# EAGLE design NANO33IoTV2.0 (EAGLE 9.4.2)

## Sheet 1 of 2
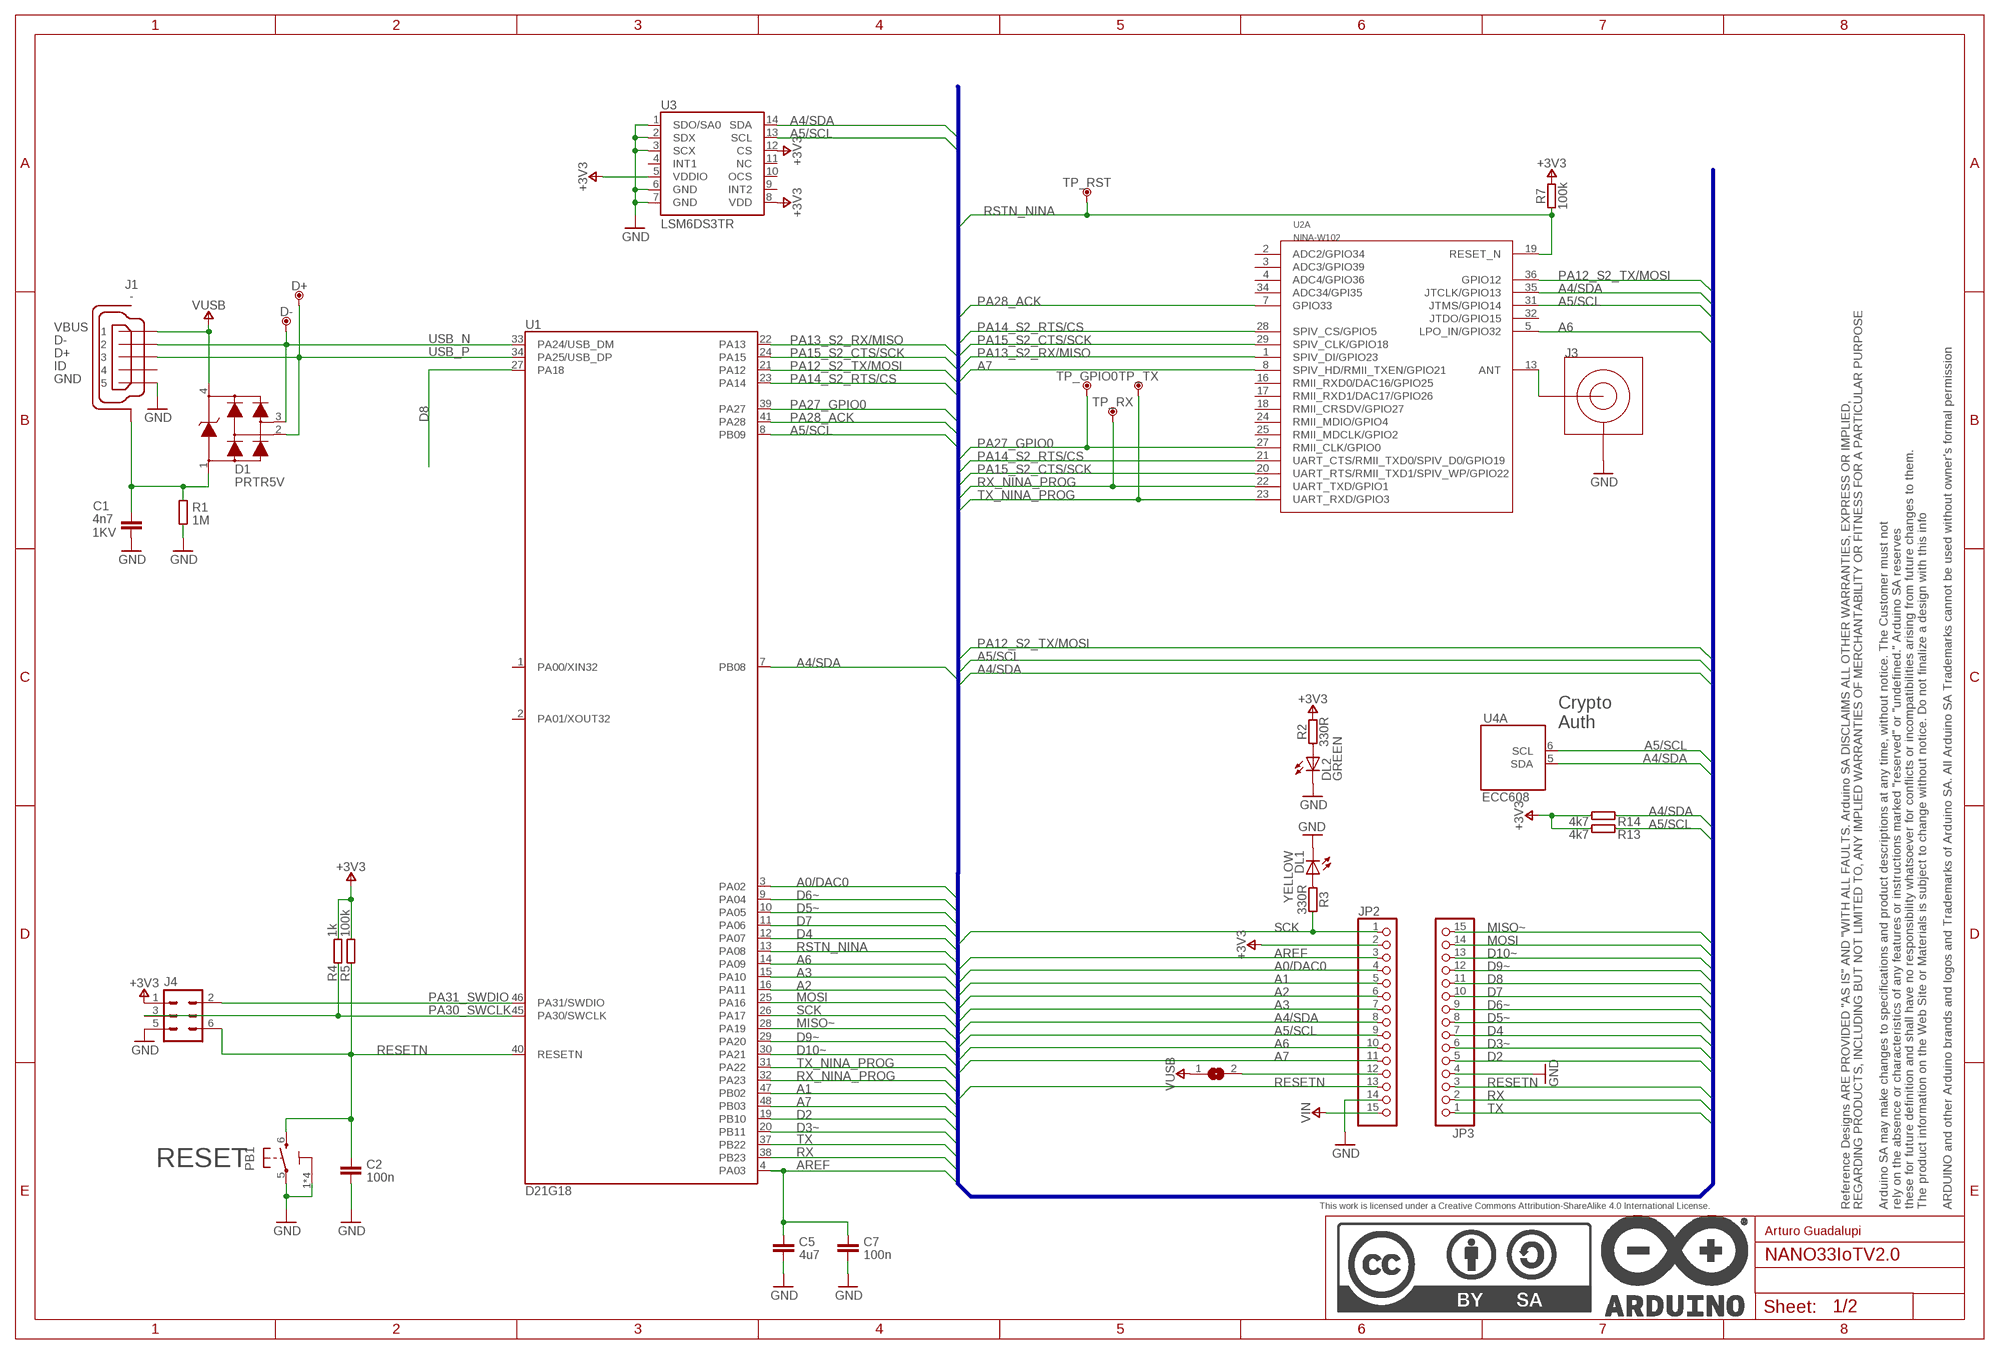
[diagram p0: schematic, sheet 1]

### Parts
C1  4n7  C4.7NF-0805  [0805-R2013X50N]
C2  100n  C-100NF-0402  [0402-1005X55N]
C5  4u7  C-4.7UF-0402  [0402-1005X55N]
C7  100n  C-100NF-0402  [0402-1005X55N]
D1  PRTR5V  PRTR5V0U2X,215  [SOT190P230X110-4N]
D+  DNP  TPTP-1.00MM  [TP-1.00MM]
D-  DNP  TPTP-1.00MM  [TP-1.00MM]
DL1  YELLOW  LED-YELLOW-0603  [LEDC1608X80N-AK]
DL2  GREEN  LED-GREEN-0603  [LEDC1608X80N-AK]
FRAME1  DNP  A3-FRAME  [FRAME]
J1  -  USB-MICRO  [ZX62-AB-5PA]
J3  DNP  UFLNO_CREAM  [U.FL-R-SMT-1(60)/NO_CREAM]
J4  DNP  PINHD-2X03(NO4)  [2X03-TP1]
JP2  PINHD-1X15-CASTELLATED  [1X15-CASTELL]
JP3  PINHD-1X15-CASTELLATED  [1X15-CASTELL]
PB1  PTS820  TACTILE1PTS820-NH  [C&K_PTS820_NO_HOLES]
R1  1M  R-1M-0402  [0402-1005X55N]
R2  330R  R-330R-0402  [0402-1005X55N]
R3  330R  R-330R-0402  [0402-1005X55N]
R4  1k  R-1K-0402  [0402-1005X55N]
R5  100k  R-100K-0402  [0402-1005X55N]
R7  100k  R-100K-0402  [0402-1005X55N]
R13  4k7  R-4K7-0402  [0402-1005X55N]
R14  4k7  R-4K7-0402  [0402-1005X55N]
SJ1  DNP  SJ  [SJ]
TP_GPIO0  DNP  TPTP-0.8MM  [TP-0.8MM]
TP_RST  DNP  TPTP-0.8MM  [TP-0.8MM]
TP_RX  DNP  TPTP-0.8MM  [TP-0.8MM]
TP_TX  DNP  TPTP-0.8MM  [TP-0.8MM]
U1  D21G18  ATSAMD21G18A-48QFN  [QFN50P700X700X90-49XN-EPSQ515]
U2  NINA-W102  NINA-W1X-102  [NINA-W1X]
U3  LSM6DS3TR  LSM6DS3LGA  [LGA14L]
U4  ECC608  ATECC-6088-UDFN  [SON50P300X200X60-9N-EP160X140]

### Nets
+3V3: J4.1 JP2.2 R2.2 R4.2 R5.2 R7.2 R13.2 R14.2 U3.5(VDDIO) U3.8(VDD) U3.12(CS) ; also sheet 2
A0/DAC0: JP2.4 U1.3(PA02)
A1: JP2.5 U1.47(PB02)
A2: JP2.6 U1.16(PA11)
A3: JP2.7 U1.15(PA10)
A4/SDA: JP2.8 R14.1 U1.7(PB08) U2.35(A:JTCLK/GPIO13) U3.14(SDA) U4.5(A:SDA)
A5/SCL: JP2.9 R13.1 U1.8(PB09) U2.31(A:JTMS/GPIO14) U3.13(SCL) U4.6(A:SCL)
A6: JP2.10 U1.14(PA09) U2.5(A:LPO_IN/GPIO32)
A7: JP2.11 U1.48(PB03) U2.8(A:SPIV_HD/RMII_TXEN/GPIO21)
AREF: C5.1 C7.1 JP2.3 U1.4(PA03)
D2: JP3.5 U1.19(PB10)
D3~: JP3.6 U1.20(PB11)
D4: JP3.7 U1.12(PA07)
D5~: JP3.8 U1.10(PA05)
D6~: JP3.9 U1.9(PA04)
D7: JP3.10 U1.11(PA06)
D8: JP3.11 U1.27(PA18)
D9~: JP3.12 U1.29(PA20)
D10~: JP3.13 U1.30(PA21)
GND: C1.2 C2.2 C5.2 C7.2 DL1.C DL2.C J1.5 J3.GND1(GND) J3.GND2(GND) J4.5 JP2.14 JP3.4 PB1.1 PB1.2 PB1.3 PB1.4 PB1.5 R1.1 U3.1(SDO/SA0) U3.2(SDX) U3.3(SCX) U3.6(GND) U3.7(GND) ; also sheet 2
MISO~: JP3.15 U1.28(PA19)
MOSI: JP3.14 U1.25(PA16)
N$1: C1.1 D1.1 J1.6(SH) J1.7(SH) J1.8(SH) J1.9(SH) J1.10(SH) J1.11(SH) R1.2
N$2: DL2.A R2.1
N$3: DL1.A R3.1
N$4: J3.SIG U2.13(A:ANT)
N$8: JP2.12 SJ1.2
PA12_S2_TX/MOSI: U1.21(PA12) U2.36(A:GPIO12)
PA13_S2_RX/MISO: U1.22(PA13) U2.1(A:SPIV_DI/GPIO23)
PA14_S2_RTS/CS: U1.23(PA14) U2.21(A:UART_CTS/RMII_TXD0/SPIV_D0/GPIO19) U2.28(A:SPIV_CS/GPIO5)
PA15_S2_CTS/SCK: U1.24(PA15) U2.20(A:UART_RTS/RMII_TXD1/SPIV_WP/GPIO22) U2.29(A:SPIV_CLK/GPIO18)
PA27_GPIO0: TP_GPIO0.X U1.39(PA27) U2.27(A:RMII_CLK/GPIO0)
PA28_ACK: U1.41(PA28) U2.7(A:GPIO33)
PA30_SWCLK: J4.3 R4.1 U1.45(PA30/SWCLK)
PA31_SWDIO: J4.2 U1.46(PA31/SWDIO)
RESETN: C2.1 J4.6 JP2.13 JP3.3 PB1.6 R5.1 U1.40(RESETN)
RSTN_NINA: R7.1 TP_RST.X U1.13(PA08) U2.19(A:RESET_N)
RX: JP3.2 U1.38(PB23)
RX_NINA_PROG: TP_RX.X U1.32(PA23) U2.22(A:UART_TXD/GPIO1)
SCK: JP2.1 R3.2 U1.26(PA17)
TX: JP3.1 U1.37(PB22)
TX_NINA_PROG: TP_TX.X U1.31(PA22) U2.23(A:UART_RXD/GPIO3)
USB_N [usb]: D1.3 D-.X J1.2 U1.33(PA24/USB_DM)
USB_P [usb]: D1.2 D+.X J1.3 U1.34(PA25/USB_DP)
VIN: JP2.15 ; also sheet 2
VUSB: D1.4 J1.1 SJ1.1 ; also sheet 2
Unconnected: J1.4 U1.1(PA00/XIN32) U1.2(PA01/XOUT32) U2.2(A:ADC2/GPIO34) U2.3(A:ADC3/GPIO39) U2.4(A:ADC4/GPIO36) U2.16(A:RMII_RXD0/DAC16/GPIO25) U2.17(A:RMII_RXD1/DAC17/GPIO26) U2.18(A:RMII_CRSDV/GPIO27) U2.24(A:RMII_MDIO/GPIO4) U2.25(A:RMII_MDCLK/GPIO2) U2.32(A:JTDO/GPIO15) U2.34(A:ADC34/GPI35) U3.4(INT1) U3.9(INT2) U3.10(OCS) U3.11(NC)

### Buses
+3V3,+3V3D,A0,A0/DAC0,A1,A2,A3,A4/SDA,A5/SCL,A6,A7,AREF,D2,D3~,D4,D5~,D6~,D7,D8,D9~,D10~,GND,LED_BLUE,LED_GREEN,LED_RED,MISO~,MOSI,PA12_S2_TX/MOSI,PA13_S2_RX/MISO,PA14_S2_RTS/CS,PA15_S2_CTS/SCK,PA22_TC4-W0,PA23_TC4-W1,PA27_GPIO0,PA28_ACK,PA30_SWCLK,PA31_SWDIO,PB08_RST,PB11_TCC0-W5,RESET#,RESETN,RSTN_NINA,RX,RX_NINA_PROG,SCK,TX,TX_NINA_PROG,USB_N,USB_P,VIN
+3V3,+3V3D,A0/DAC0,A1,A2,A3,A4/SDA,A5/SCL,A6,A7,AREF,D2,D3~,D4,D5~,D6~,D7,D8,D9~,D10~,GND,LED_BLUE,LED_GREEN,LED_RED,MISO~,MOSI,N$1,N$2,N$3,N$5,N$6,N$7,N17852357,N17852431,PA12_S2_TX/MOSI,PA13_S2_RX/MISO,PA14_S2_RTS/CS,PA15_S2_CTS/SCK,PA27_GPIO0,PA28_ACK,PA30_SWCLK,PA31_SWDIO,PB08_RST,RESETN,RSTN_NINA,RX,RX_NINA_PROG,SCK,TX,TX_NINA_PROG,USB_N,USB_P,VIN,VUSB

### Notes on the sheet
- Crypto
  Auth
- RESET
- Arturo Guadalupi

## Sheet 2 of 2
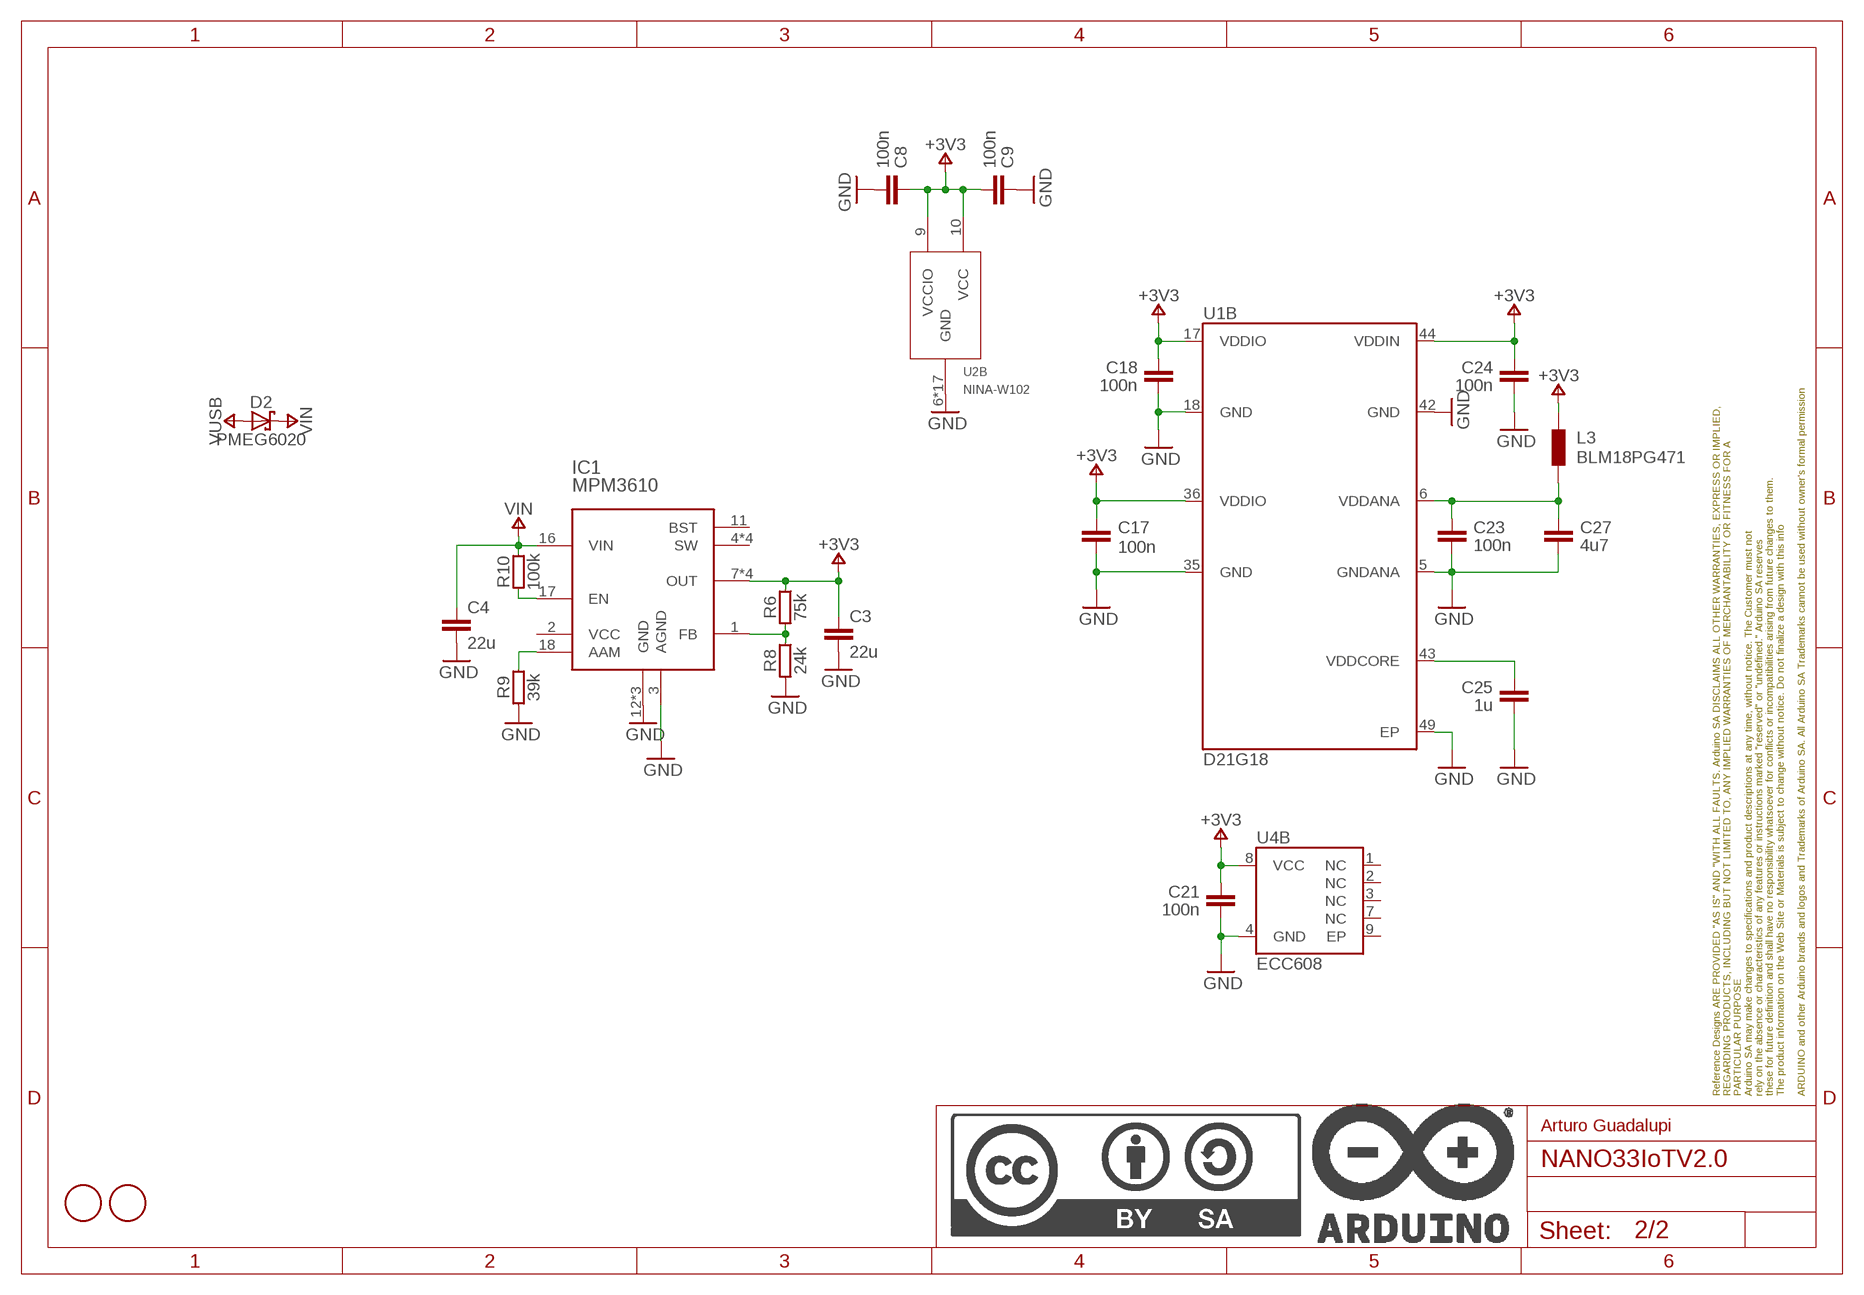
[diagram p1: schematic, sheet 2]

### Parts
C3  22u  C-22U-0805  [0805-R2013X50N]
C4  22u  C-22U-0805  [0805-R2013X50N]
C8  100n  C-100NF-0402  [0402-1005X55N]
C9  100n  C-100NF-0402  [0402-1005X55N]
C17  100n  C-100NF-0402  [0402-1005X55N]
C18  100n  C-100NF-0402  [0402-1005X55N]
C21  100n  C-100NF-0402  [0402-1005X55N]
C23  100n  C-100NF-0402  [0402-1005X55N]
C24  100n  C-100NF-0402  [0402-1005X55N]
C25  1u  C-1UF-0402  [0402-1005X55N]
C27  4u7  C-4.7UF-0603  [0603-1608X90N]
D2  PMEG6020  PMEG6020AELRX  [SODFL3517X110N]
FD1  DNP  FIDUCIAL-1.5MM  [FD-1-1.5]
FD2  DNP  FIDUCIAL-1.5MM  [FD-1-1.5]
IC1  MPM3610  [MPM3610]
L3  BLM18PG471  FERRITE-470R0603  [0603-1608X90N]
R6  75k  R-75K-0402  [0402-1005X55N]
R8  24k  R-24K-0402  [0402-1005X55N]
R9  39k  R-39K-0402  [0402-1005X55N]
R10  100k  R-100K-0402  [0402-1005X55N]
U$1  DNP  A4L-LOC  [FRAME]

### Nets
+3V3: C3.1 C8.1 C9.2 C17.1 C18.1 C21.1 C24.1 IC1.7(OUT) IC1.8(OUT) IC1.9(OUT) IC1.20(OUT) L3.1 R6.2 U1.17(VDDIO) U1.36(VDDIO) U1.44(VDDIN) U2.9(B:VCCIO) U2.10(B:VCC) U4.8(B:VCC) ; also sheet 1
GND: C3.2 C4.2 C8.2 C9.1 C17.2 C18.2 C21.2 C23.2 C24.2 C25.2 C27.2 IC1.3(AGND) IC1.12(GND) IC1.13(GND) IC1.14(GND) R8.1 R9.1 U1.5(GNDANA) U1.18(GND) U1.35(GND) U1.42(GND) U1.49(EP) U2.6(B:GND) U2.12(B:GND) U2.14(B:GND) U2.26(B:GND) U2.30(B:GND) U2.GND@1(B:GND) U2.GND@2(B:GND) U2.GND@3(B:GND) U2.GND@4(B:GND) U2.GND@5(B:GND) U2.GND@6(B:GND) U2.GND@7(B:GND) U2.GND@8(B:GND) U2.GND@9(B:GND) U2.GND@10(B:GND) U2.GND@11(B:GND) U2.GND@12(B:GND) U4.4(B:GND) ; also sheet 1
N17852357: C23.1 C27.1 L3.2 U1.6(VDDANA)
N17852431: C25.1 U1.43(VDDCORE)
N$5: IC1.1(FB) R6.1 R8.2
N$6: IC1.18(AAM) R9.2
N$7: IC1.17(EN) R10.1
VIN: C4.1 D2.C IC1.16(VIN) R10.2 ; also sheet 1
VUSB: D2.A ; also sheet 1
Unconnected: IC1.2(VCC) IC1.4(SW) IC1.5(SW) IC1.6(SW) IC1.11(BST) IC1.19(SW) U4.1(B:NC) U4.2(B:NC) U4.3(B:NC) U4.7(B:NC) U4.9(B:EP)

### Notes on the sheet
- Arturo Guadalupi

## Library data of the parts
C1 = Arduino-rcl:C: SMD Capacitor; CODE-ARDUINO: 0689; DATASHEET: http://www.kemet.com/Lists/ProductCatalog/Attachments/40/KEM_C1010_X7R_HV_SMD.pdf; DISTRIBUTOR-LINK: www.kemet.com/docfinder?Partnumber=C0805C472KDRACTU; DISTRIBUTOR-PN: 399-6738-1-ND; MANUFACTURER: Kemet; MANUFACTURER-PN: C0805C472KDRACTU; NOTE: -; VOLTAGE: 1KV
C2 C7-C9 C17 C18 C21 C23 C24 = Arduino-rcl:C: SMD Capacitor; CODE-ARDUINO: 0132; DATASHEET: http://www.tdk.com/pdf/TDKMLCCCapRange.pdf; DISTRIBUTOR-LINK: http://www.digikey.com/product-detail/en/tdk-corporation/C1005X5R1H104K050BB/445-5942-1-ND/2443982; DISTRIBUTOR-PN: 445-5942-1-ND; MANUFACTURER: TDK; MANUFACTURER-PN: C1005X5R1H104K050BB; NOTE: -
C3 C4 = Arduino-rcl:C: SMD Capacitor; CODE-ARDUINO: 2233; DATASHEET: https://media.digikey.com/pdf/Data%20Sheets/Samsung%20PDFs/CL21A226MQCLQNC_character.pdf; DISTRIBUTOR-LINK: https://www.digikey.com/product-detail/en/samsung-electro-mechanics-america-inc/CL21A226MQCLQNC/1276-2412-1-ND/3890498; DISTRIBUTOR-PN: 1276-2412-1-ND; MANUFACTURER: Samsung; MANUFACTURER-PN: CL21A226MQCLQNC; NOTE: -
C5 = Arduino-rcl:C: SMD Capacitor; CODE-ARDUINO: 0833; DATASHEET: http://search.murata.co.jp/Ceramy/image/img/A01X/partnumbering_e_01.pdf; DISTRIBUTOR-LINK: http://www.digikey.com/product-detail/en/murata-electronics-north-america/GRM155R60J475ME47D/490-5915-1-ND/3719860; DISTRIBUTOR-PN: 490-5915-1-ND; MANUFACTURER: Murata; MANUFACTURER-PN: GRM155R60J475ME47D; NOTE: -
C25 = Arduino-rcl:C: SMD Capacitor; CODE-ARDUINO: 0133; DATASHEET: http://search.murata.co.jp/Ceramy/image/img/A01X/partnumbering_e_01.pdf; DISTRIBUTOR-LINK: http://www.digikey.com/product-detail/en/murata-electronics-north-america/GRM155R61E105KA12D/490-10017-1-ND/5026367; DISTRIBUTOR-PN: 490-10017-1-ND; MANUFACTURER: Murata; MANUFACTURER-PN: GRM155R61E105KA12D; NOTE: -
C27 = Arduino-rcl:C: SMD Capacitor; CODE-ARDUINO: 0458; DATASHEET: http://www.murata.com/~/media/webrenewal/support/library/catalog/products/capacitor/mlcc/c02e.pdf; DISTRIBUTOR-LINK: http://www.digikey.com/product-search/en?keywords=490-7203-1-ND; DISTRIBUTOR-PN: 490-7203-1-ND; MANUFACTURER: Murata; MANUFACTURER-PN: GRM188R61E475KE11D; NOTE: -
D1 = Arduino-diodes:PRTR5V0U2X,215: USB ESD protection; CODE-ARDUINO: 2209; DATASHEET: http://www.nxp.com/documents/data_sheet/PRTR5V0U2X.pdf; DISTRIBUTOR-LINK: http://www.digikey.com/product-detail/en/nxp-semiconductors/PRTR5V0U2X,215/568-4140-1-ND/1589981; DISTRIBUTOR-PN: 568-4140-1-ND; MANUFACTURER: NXP; MANUFACTURER-PN: PRTR5V0U2X,215
D2 = Arduino-diodes:PMEG6020AELRX: 60 V, 2 A low leakage current Schottky barrier rectifier Datasheet <http://www.nxp.com/documents/data_sheet/PMEG6020AELR.pdf>; CODE-ARDUINO: 2208; DATASHEET: http://www.nxp.com/documents/data_sheet/PMEG6020AELR.pdf; DISTRIBUTOR-LINK: http://www.digikey.com/products/en?keywords=%20568-12710-1-ND; DISTRIBUTOR-PN: 568-12710-1-ND; MANUFACTURER: NXP; MANUFACTURER-PN: PMEG6020AELRX
D+ D- TP_GPIO0 TP_RST TP_RX TP_TX = Arduino-utility:TP: Testpoint; CODE-ARDUINO: DNP; DATASHEET: DNP; DISTRIBUTOR-LINK: DNP; DISTRIBUTOR-PN: DNP; MANUFACTURER: DNP; MANUFACTURER-PN: DNP
DL1 = Arduino-diodes:LED: LED; CODE-ARDUINO: 2243; DATASHEET: http://media.digikey.com/pdf/Data%20Sheets/Avago%20PDFs/HSMz-Czzz.pdf; DISTRIBUTOR-LINK: http://www.digikey.com/product-detail/en/broadcom-limited/HSMY-C190/516-1424-1-ND/637748; DISTRIBUTOR-PN: 516-1424-1-ND; MANUFACTURER: Avago; MANUFACTURER-PN: HSMY-C190
DL2 = Arduino-diodes:LED: LED; CODE-ARDUINO: 2204; DATASHEET: http://media.digikey.com/pdf/Data%20Sheets/Avago%20PDFs/HSMz-Czzz.pdf; DISTRIBUTOR-LINK: http://www.digikey.com/product-detail/en/broadcom-limited/HSMG-C190/516-1425-1-ND/637749; DISTRIBUTOR-PN: 516-1425-1-ND; MANUFACTURER: Avago; MANUFACTURER-PN: HSMG-C190
FD1 FD2 = Arduino-utility:FIDUCIAL: Fiducial mount; CODE-ARDUINO: DNP; DATASHEET: DNP; DISTRIBUTOR-LINK: DNP; DISTRIBUTOR-PN: DNP; MANUFACTURER: DNP; MANUFACTURER-PN: DNP
FRAME1 = Arduino-utility:A3-FRAME; CODE-ARDUINO: DNP; DATASHEET: DNP; DISTRIBUTOR-LINK: DNP; DISTRIBUTOR-PN: DNP; MANUFACTURER: DNP; MANUFACTURER-PN: DNP; NOTE: DNP
IC1 = Arduino-ICs:MPM3610: MPM3610 Step Down Regulator; CODE-ARDUINO: 2093; DATASHEET: https://www.monolithicpower.com/pub/media/document/MPM3610_r1.01.pdf; DISTRIBUTOR-LINK: https://www.digikey.com/product-detail/en/monolithic-power-systems-inc/MPM3610AGQV-P/1589-1249-1-ND/5298336; DISTRIBUTOR-PN: 1589-1249-1-ND; MANUFACTURER: MPS; MANUFACTURER-PN: MPM3610AGQV-P; RESTRICTIONS: NO
J1 = Arduino-connectors:USB-MICRO: USB - micro AB USB 2.0 Receptacle Connector 5 Position Surface Mount, Right Angle, Horizontal; CODE-ARDUINO: 2219; DATASHEET: https://www.hirose.com/product/en/download_file/key_name/ZX/category/Catalog/doc_file_id/31704/?file_category_id=4&item_id=13&is_series=1; DISTRIBUTOR-LINK: http://www.digikey.com/product-detail/en/hirose-electric-co-ltd/ZX62-AB-5PA(31)/H125279CT-ND/5994741; DISTRIBUTOR-PN: H125279CT-ND; MANUFACTURER: Hirose; MANUFACTURER-PN: ZX62-AB-5PA(31)
J3 = Arduino-connectors:UFL: U.FL, Ultra Miniature Coaxial Connector Receptacle, Male Pin 50 Ohm Surface Mount Solder; CODE-ARDUINO: DNP; DATASHEET: DNP; DISTRIBUTOR-PN: DNP; MANUFACTURER: DNP; MANUFACTURER-PN: DNP
J4 = Arduino-connectors:PINHD-2X03(NO4): PIN HEADER; CODE-ARDUINO: DNP; DATASHEET: DNP; DISTRIBUTOR-LINK: DNP; DISTRIBUTOR-PN: DNP; MANUFACTURER: DNP; MANUFACTURER-PN: DNP
JP2 JP3 = Arduino-connectors:PINHD-1X15: PIN HEADER
L3 = Arduino-rcl:FERRITE: SMD ferrite; CODE-ARDUINO: 2200; DATASHEET: http://search.murata.co.jp/Ceramy/image/img/PDF/ENG/L0110S0100BLM18P.pdf; DISTRIBUTOR-LINK: http://www.digikey.com/product-detail/en/murata-electronics-north-america/BLM18PG471SN1D/490-5223-1-ND/1948399; DISTRIBUTOR-PN: 490-5223-1-ND; MANUFACTURER: Murata; MANUFACTURER-PN: BLM18PG471SN1D; NOTE: -
PB1 = Arduino-pushbuttons:TACTILE1: Tactile Switch SPST-NO Top Actuated Surface Mount; CODE-ARDUINO: 0173; DATASHEET: http://www.ckswitches.com/media/1474/pts820.pdf; DISTRIBUTOR-LINK: https://www.digikey.com/product-detail/en/c-k/PTS820-J15M-SMTR-LFS/CKN10506CT-ND/4176681; DISTRIBUTOR-PN: PTS820 J25K SMTR LFS-ND; MANUFACTURER: C&K; MANUFACTURER-PN: PTS820 J25K SMTR LFS
R1 = Arduino-rcl:R: SMD Resistor; CODE-ARDUINO: 0139; DATASHEET: www.yageo.com.tw/exep/pages/download/literatures/PYu-R_INT-thick_7.pdf; DISTRIBUTOR-LINK: http://www.digikey.com/product-detail/en/yageo/RC0402JR-07330RL/311-330JRCT-ND/729412; DISTRIBUTOR-PN: 311-330JRCT-ND; MANUFACTURER: Yageo; MANUFACTURER-PN: RC0402JR-07330RL; NOTE: NO
R2 R3 = Arduino-rcl:R: SMD Resistor; CODE-ARDUINO: 2229; DATASHEET: www.yageo.com.tw/exep/pages/download/literatures/PYu-R_INT-thick_7.pdf; DISTRIBUTOR-LINK: http://www.digikey.com/product-detail/en/yageo/RC0402FR-07330RL/311-330LRCT-ND/729541; DISTRIBUTOR-PN: 311-330LRCT-ND; MANUFACTURER: Yageo; MANUFACTURER-PN: RC0402FR-07330RL; NOTE: NO
R4 = Arduino-rcl:R: SMD Resistor; CODE-ARDUINO: 0140; DATASHEET: www.yageo.com.tw/exep/pages/download/literatures/PYu-R_INT-thick_7.pdf; DISTRIBUTOR-LINK: http://www.digikey.com/product-detail/en/yageo/RC0402FR-071KL/311-1.00KLRCT-ND/729460; DISTRIBUTOR-PN: 311-1.00KLRCT-ND; MANUFACTURER: Yageo; MANUFACTURER-PN: RC0402FR-071KL; NOTE: NO
R5 R7 R10 = Arduino-rcl:R: SMD Resistor; CODE-ARDUINO: 0134; DATASHEET: www.yageo.com.tw/exep/pages/download/literatures/PYu-R_INT-thick_7.pdf; DISTRIBUTOR-LINK: http://www.digikey.com/product-detail/en/yageo/RC0402FR-07100KL/311-100KLRCT-ND/729473; DISTRIBUTOR-PN: 311-100KLRCT-ND; MANUFACTURER: Yageo; MANUFACTURER-PN: RC0402FR-07100KL; NOTE: NO
R6 = Arduino-rcl:R: SMD Resistor; DATASHEET: www.yageo.com.tw/exep/pages/download/literatures/PYu-R_INT-thick_7.pdf; DISTRIBUTOR-LINK: https://www.digikey.com/products/en?keywords=%20AC0402JR-0775KL; DISTRIBUTOR-PN: AC0402JR-0775KL-ND; MANUFACTURER: Yageo; MANUFACTURER-PN: AC0402JR-0775KL; NOTE: NO
R8 = Arduino-rcl:R: SMD Resistor; CODE-ARDUINO: -; DATASHEET: http://www.yageo.com/NewPortal/yageodocoutput?fileName=/pdf/R-Chip/PYu-AC_51_RoHS_L_6.pdf; DISTRIBUTOR-LINK: https://www.digikey.com/products/en?keywords=AC0402JR-0724KL; DISTRIBUTOR-PN: AC0402JR-0724KL-ND; MANUFACTURER: Yageo; MANUFACTURER-PN: AC0402JR-0724KL; NOTE: NO
R9 = Arduino-rcl:R: SMD Resistor; CODE-ARDUINO: -; DATASHEET: www.yageo.com.tw/exep/pages/download/literatures/PYu-R_INT-thick_7.pdf; DISTRIBUTOR-LINK: https://www.digikey.com/product-detail/en/yageo/RC0402JR-0739KL/311-39KJRCT-ND/729420; DISTRIBUTOR-PN: 311-39KJRCT-ND; MANUFACTURER: Yageo; MANUFACTURER-PN: RC0402JR-0739KL; NOTE: NO
R13 R14 = Arduino-rcl:R: SMD Resistor; CODE-ARDUINO: 2196; DATASHEET: www.yageo.com.tw/exep/pages/download/literatures/PYu-R_INT-thick_7.pdf; DISTRIBUTOR-LINK: http://www.digikey.com/product-detail/en/yageo/RC0402FR-074K7L/311-4.7KLRCT-ND/2827881; DISTRIBUTOR-PN: 311-4.7KLRCT-ND; MANUFACTURER: Yageo; MANUFACTURER-PN: RC0402FR-074K7L; NOTE: NO
SJ1 = Arduino-utility:SJ: SMD solder JUMPER; CODE-ARDUINO: DNP; DATASHEET: DNP; DISTRIBUTOR-LINK: DNP; DISTRIBUTOR-PN: DNP; MANUFACTURER: DNP; MANUFACTURER-PN: DNP
U1 = Arduino-ucs&SoCs:ATSAMD21G18A-48: ARM® Cortex®-M0+ SAM D21G Microcontroller IC 32-Bit 48MHz 256KB (256K x 8) FLASH 48-TQFP (7x7); CODE-ARDUINO: ATSAMD21G18A-MU; DATASHEET: http://www.atmel.com/Images/Atmel-42181-SAM-D21_Datasheet.pdf; DISTRIBUTOR-LINK: https://www.digikey.com/product-detail/en/microchip-technology/ATSAMD21G18A-MU/ATSAMD21G18A-MU-ND/4935894; DISTRIBUTOR-PN: ATSAMD21G18A-MU-ND; MANUFACTURER: Atmel; MANUFACTURER-PN: ATSAMD21G18A-MU
U2 = Arduino-ucs&SoCs:NINA-W1X: ESP32 WiFi/BLE module; CODE-ARDUINO: NINA-W102; DATASHEET: https://www.u-blox.com/sites/default/files/NINA-W1_DataSheet_%28UBX-17006694%29.pdf; DISTRIBUTOR-LINK: https://www.digikey.com/product-detail/en/u-blox-america-inc/NINA-W102/672-1070-1-ND/7931820; DISTRIBUTOR-PN: 672-1070-1-ND; MANUFACTURER: Ublocks; MANUFACTURER-PN: NINA-W102
U3 = Arduino-Sensors:LSM6DS3: 6DOF IMU; CODE-ARDUINO: 2326; DATASHEET: https://www.st.com/content/ccc/resource/technical/document/datasheet/a3/f5/4f/ae/8e/44/41/d7/DM00133076.pdf/files/DM00133076.pdf/jcr:content/translations/en.DM00133076.pdf; DISTRIBUTOR-LINK: https://www.digikey.com/product-detail/en/stmicroelectronics/LSM6DS3TR/497-15383-1-ND/5180534; DISTRIBUTOR-PN: 497-15383-1-ND; MANUFACTURER: ST; MANUFACTURER-PN: LSM6DS3TR
U4 = Arduino-ICs:ATECC: Secure authentication and product validation device, EEPROM, I2C, 2.0 - 5.5V; CODE-ARDUINO: ATECC608A-MAHDA-T; DATASHEET: http://ww1.microchip.com/downloads/en/DeviceDoc/40001977A.pdf; DISTRIBUTOR-LINK: https://www.digikey.com/product-detail/en/microchip-technology/ATECC608A-MAHDA-T/ATECC608A-MAHDA-TCT-ND/7928236; DISTRIBUTOR-PN: ATECC608A-MAHDA-TCT-ND; MANUFACTURER: Microchip; MANUFACTURER-PN: ATECC608A-MAHDA-T; NOTE: NO
U$1 = Arduino-utility:A4L-LOC; CODE-ARDUINO: DNP; DATASHEET: DNP; DISTRIBUTOR-LINK: DNP; DISTRIBUTOR-PN: DNP; MANUFACTURER: DNP; MANUFACTURER-PN: DNP; NOTE: DNP

## Net classes
0 default: width 0.19 mm, drill 0.19 mm
1 usb: width 0.19 mm, drill 0.19 mm, clearance 0.127 mm

## Board
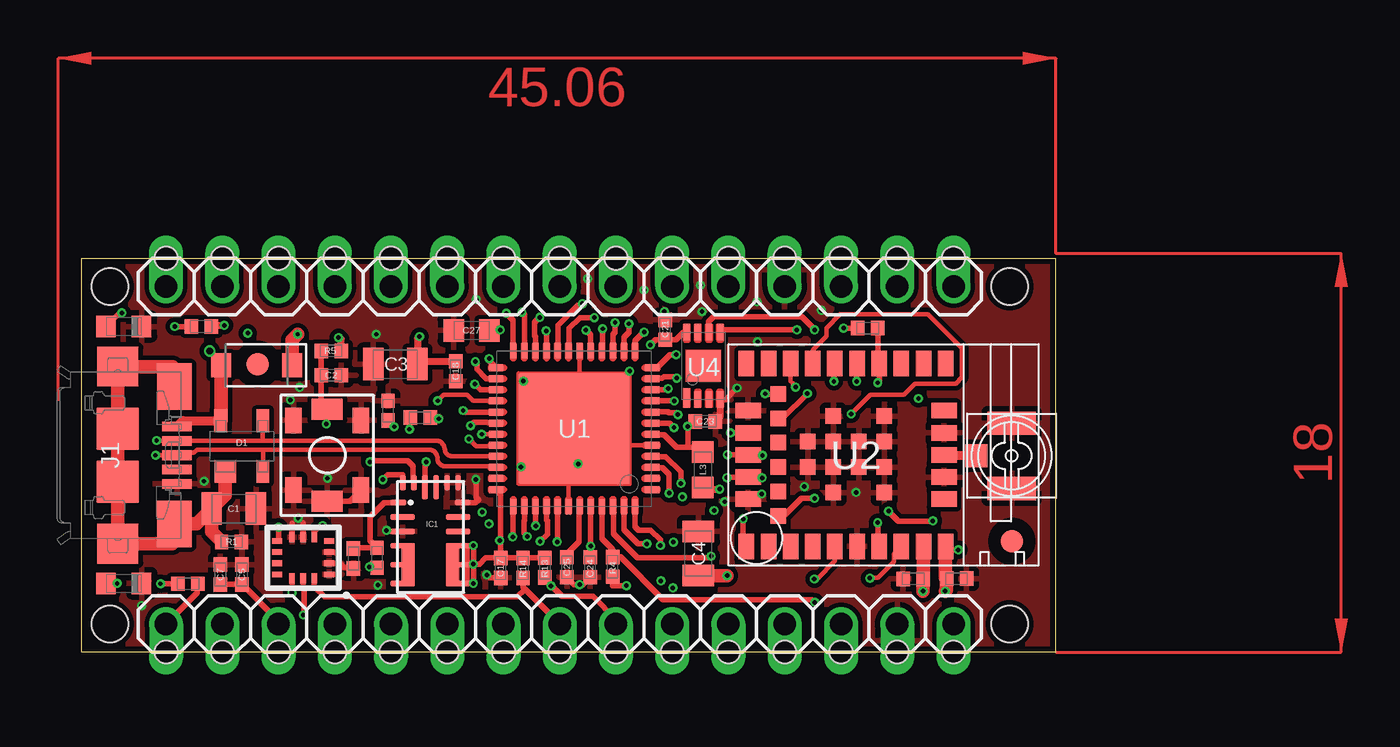
[diagram p2: board, top side]
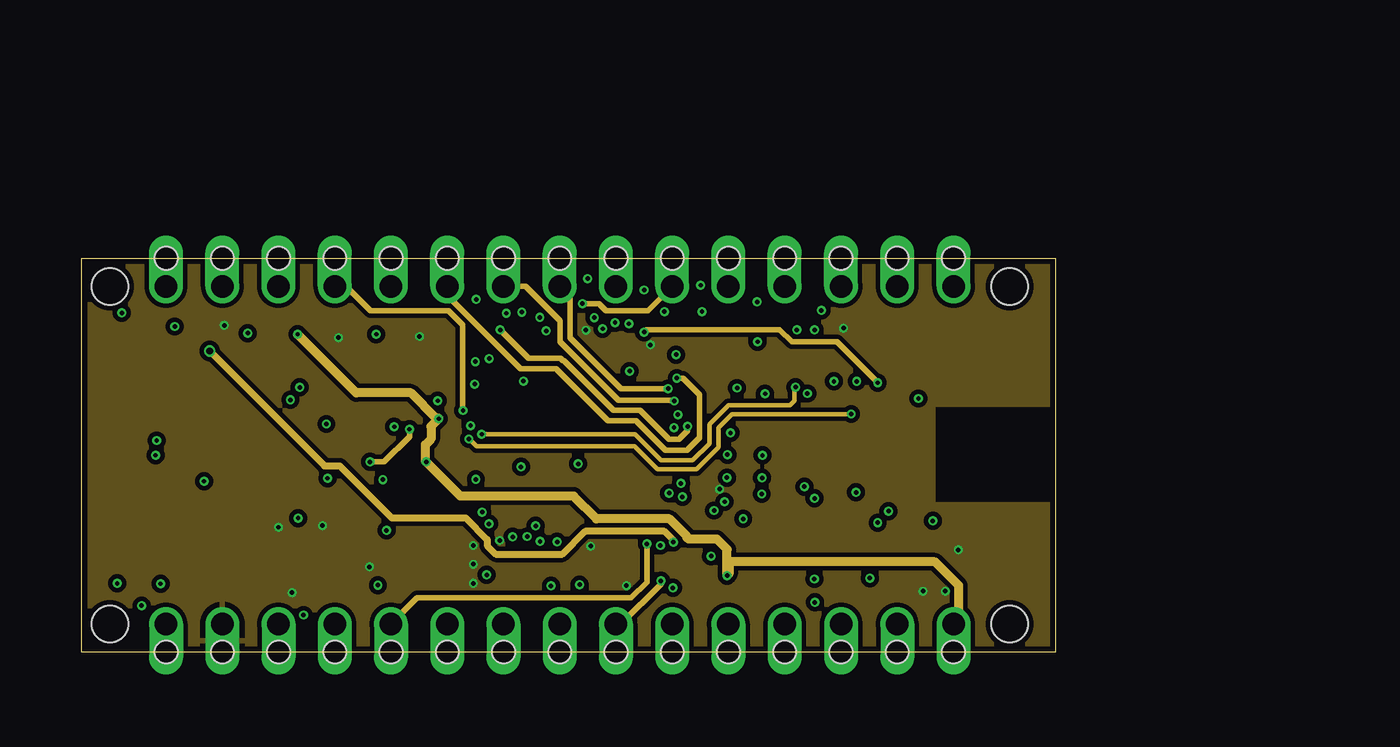
[diagram p3: board, inner layer PWR]
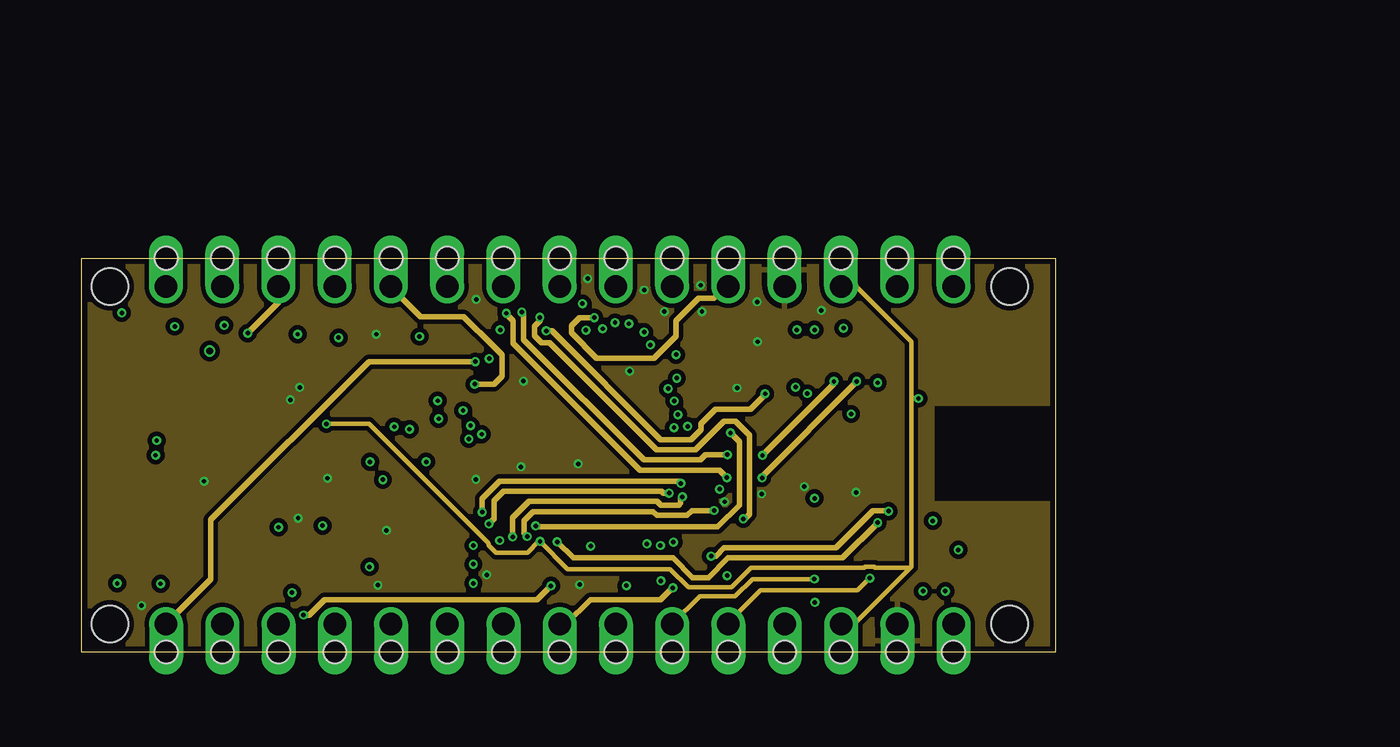
[diagram p4: board, inner layer MID]
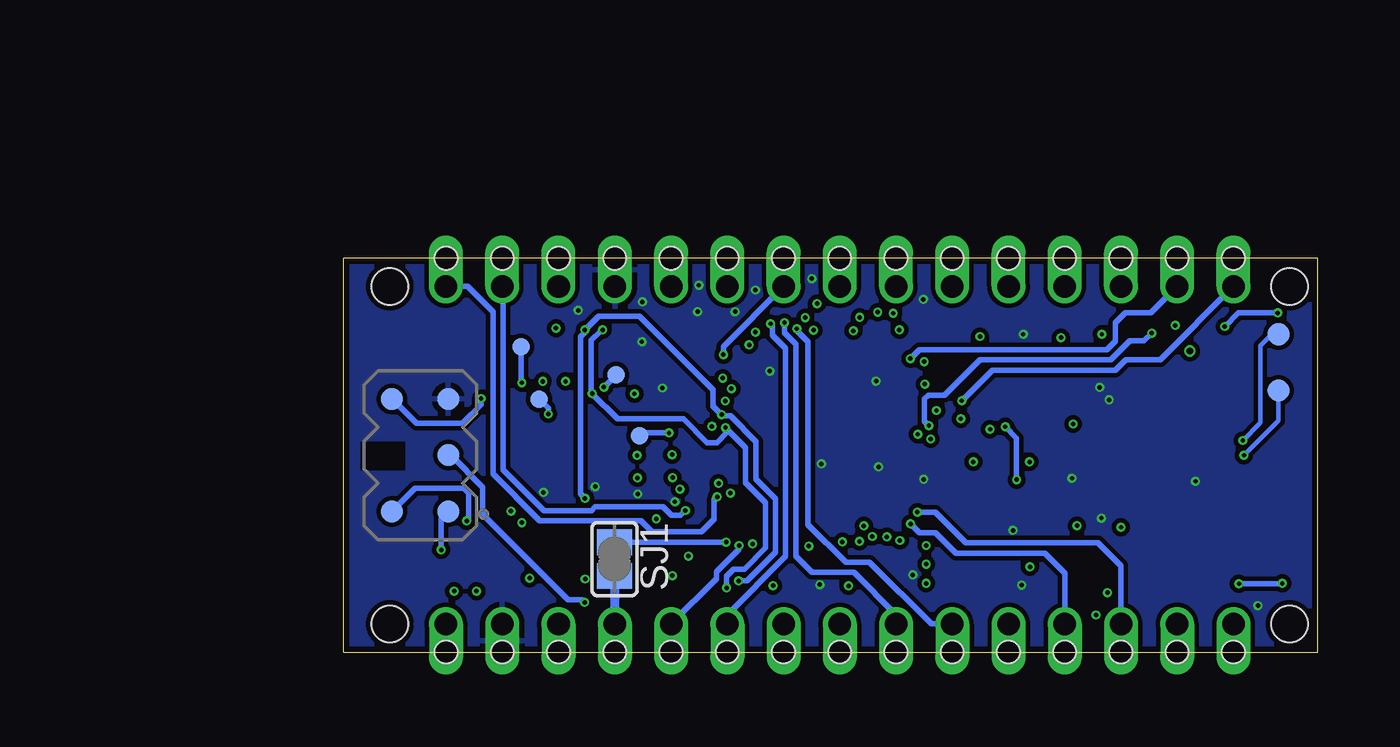
[diagram p5: board, bottom side, seen from below]

Size 44 x 17.78 mm. Coordinates in mm from the lower left corner, seen from the top.
Outline: 0,0 0,17.78 44,17.78 44,0 0,0
Copper layers (1*2*15*16): Top 0.035mm / dielectric 0.2mm / PWR 0.0175mm / dielectric 0.3mm / MID 0.0175mm / dielectric 0.2mm / Bottom 0.035mm
Design rules "SeeedStudio_4layers *": minimum track width 8mil, minimum drill 0.19mm, track to track 8mil, track to pad 8mil, pad to pad 8mil, via to via 8mil, smd to smd 0mil, copper to edge 10mil, drill to drill 8mil, minimum pad ring 6mil, minimum via ring 4mil, stop-mask expansion 4mil, vias tented up to drill 25mil, thermal gap 10mil
Holes 1.65 mm at 1.27,16.51 1.27,1.27 41.91,1.27 41.91,16.51
tRestrict: area 41.2,8.2 to 43.2,9.5
bRestrict: area 41.2,8.2 to 43.2,9.5

### Footprints (pad centres in the part's own frame; a part is rotated, then mirrored left to right if it is on the bottom)
0805-R2013X50N = smd 0.95 x 1.45: 1 -1,0; 2 1,0
0402-1005X55N = smd 0.62 x 0.62: 1 -0.45,0; 2 0.45,0
0603-1608X90N = smd 0.95 x 1: 1 -0.8,0; 2 0.8,0
SOT190P230X110-4N = smd 1 x 1: 1 -1.15,0.75 | smd 1 x 0.6: 2 -1.15,-0.95; 3 1.15,-0.95; 4 1.15,0.95
SODFL3517X110N = smd 0.91 x 1.07: A 1.605,0; C -1.605,0
TP-1.00MM = smd 1 x 1 bottom: X 0,0
LEDC1608X80N-AK = smd 0.9 x 0.95: A 0.8,0; C -0.8,0
FD-1-1.5 = smd 1.016 x 1.016: P$1 0,0
MPM3610 = smd 0.7 x 0.25: 1 -1.45,1.55; 4 -1.45,-0.4; 5 -1.45,-1.25; 6 -1.45,-2.1; 7 1.45,-2.1; 8 1.45,-1.25; 9 1.45,-0.4; 12 1.45,1.55 | smd 1.1 x 0.25: 2 -1.25,0.9; 3 -1.25,0.25; 10 1.25,0.25; 11 1.25,0.9 | smd 0.25 x 0.7: 13 1.25,2.45; 14 0.75,2.45; 17 -0.75,2.45; 18 -1.25,2.45 | smd 0.25 x 1.1: 15 0.25,2.25; 16 -0.25,2.25 | smd 0.6 x 1.95: 19 -1,-1.25; 20 1,-1.25
ZX62-AB-5PA = smd 0.4 x 1.35: 1 -1.3,3.025; 2 -0.65,3.025; 3 0,3.025; 4 0.65,3.025; 5 1.3,3.025 | smd 2.1 x 1.6: 6 3.1,2.9; 11 -3.1,2.9 | smd 1.8 x 1.9: 7 4,0.35; 10 -4,0.35 | smd 1.9 x 1.9: 8 1.2,0.35; 9 -1.2,0.35
U.FL-R-SMT-1(60)/NO_CREAM = smd 1.05 x 2.2: GND1 -1.475,0; GND2 1.475,0 | smd 1.05 x 1: SIG 0,-1.6
2X03-TP1 = smd 1 x 1 bottom: 1 -2.54,1.27; 2 -2.54,-1.27; 3 0,1.27; 5 2.54,1.27; 6 2.54,-1.27
1X15-CASTELL = drill 1.016 offset: 1 -17.78,0; 2 -15.24,0; 3 -12.7,0; 4 -10.16,0; 5 -7.62,0; 6 -5.08,0; 7 -2.54,0; 8 0,0; 9 2.54,0; 10 5.08,0; 11 7.62,0; 12 10.16,0; 13 12.7,0; 14 15.24,0; 15 17.78,0 | hole 1.016: 17.78,-1.27; 15.24,-1.27; 12.7,-1.27; 10.16,-1.27; 7.62,-1.27; 5.08,-1.27; 2.54,-1.27; 0,-1.27; -2.54,-1.27; -5.08,-1.27; -7.62,-1.27; -10.16,-1.27; -12.7,-1.27; -15.24,-1.27; -17.78,-1.27
C&K_PTS820_NO_HOLES = smd 1.15 x 0.75: 1 -1.575,1.525; 2 -1.575,-1.525; 3 1.575,1.525; 4 1.575,-1.525 | smd 0.95 x 1.4: 5 -2.075,0; 6 2.075,0
SJ = smd 1.168 x 1.6: 1 -0.762,0; 2 0.762,0
TP-0.8MM = smd 0.8 x 0.8 bottom: X 0,0
QFN50P700X700X90-49XN-EPSQ515 = smd 0.65 x 0.28: 1 -3.525,2.75; 2 -3.525,2.25; 3 -3.525,1.75; 4 -3.525,1.25; 5 -3.525,0.75; 6 -3.525,0.25; 7 -3.525,-0.25; 8 -3.525,-0.75; 9 -3.525,-1.25; 10 -3.525,-1.75; 11 -3.525,-2.25; 12 -3.525,-2.75; 25 3.525,-2.75; 26 3.525,-2.25; 27 3.525,-1.75; 28 3.525,-1.25; 29 3.525,-0.75; 30 3.525,-0.25; 31 3.525,0.25; 32 3.525,0.75; 33 3.525,1.25; 34 3.525,1.75; 35 3.525,2.25; 36 3.525,2.75 | smd 0.28 x 0.65: 13 -2.75,-3.525; 14 -2.25,-3.525; 15 -1.75,-3.525; 16 -1.25,-3.525; 17 -0.75,-3.525; 18 -0.25,-3.525; 19 0.25,-3.525; 20 0.75,-3.525; 21 1.25,-3.525; 22 1.75,-3.525; 23 2.25,-3.525; 24 2.75,-3.525; 37 2.75,3.525; 38 2.25,3.525; 39 1.75,3.525; 40 1.25,3.525; 41 0.75,3.525; 42 0.25,3.525; 43 -0.25,3.525; 44 -0.75,3.525; 45 -1.25,3.525; 46 -1.75,3.525; 47 -2.25,3.525; 48 -2.75,3.525 | smd 5 x 5: 49 0,0
NINA-W1X = smd 0.7 x 1.15: 1 4.95,4.125; 2 3.95,4.125; 3 2.95,4.125; 4 1.95,4.125; 5 0.95,4.125; 6 -0.05,4.125; 7 -1.05,4.125; 8 -2.05,4.125; 9 -3.05,4.125; 10 -4.05,4.125; 16 -4.05,-4.125; 17 -3.05,-4.125; 18 -2.05,-4.125; 19 -1.05,-4.125; 20 -0.05,-4.125; 21 0.95,-4.125; 22 1.95,-4.125; 23 2.95,-4.125; 24 3.95,-4.125; 25 4.95,-4.125 | smd 1.15 x 0.7: 11 -3.975,2; 12 -3.975,1; 13 -3.975,0; 14 -3.975,-1; 15 -3.975,-2; 26 4.875,-2; 27 4.875,-1; 28 4.875,0; 29 4.875,1; 30 4.875,2 | smd 0.7 x 0.7: 31 3.5,2.75; 32 3.5,1.65; 33 3.5,0.55; 34 3.5,-0.55; 35 3.5,-1.65; 36 3.5,-2.75; GND@1 -1.28,1.7; GND@2 -1.28,0.55; GND@3 -1.28,-0.6; GND@4 -1.28,-1.75; GND@5 -0.13,0.55; GND@6 -0.13,-0.6; GND@7 1.02,1.7; GND@8 1.02,0.55; GND@9 1.02,-0.6; GND@10 1.02,-1.75; GND@11 2.17,0.55; GND@12 2.17,-0.6
LGA14L = smd 0.45 x 0.25: 1 -1.175,0.75; 2 -1.175,0.25; 3 -1.175,-0.25; 4 -1.175,-0.75; 8 1.175,-0.75; 9 1.175,-0.25; 10 1.175,0.25; 11 1.175,0.75 | smd 0.25 x 0.45: 5 -0.5,-0.925; 6 0,-0.925; 7 0.5,-0.925; 12 0.5,0.925; 13 0,0.925; 14 -0.5,0.925
SON50P300X200X60-9N-EP160X140 = smd 0.3 x 0.85: 1 -0.75,-1.45 | smd 0.3 x 0.7: 2 -0.25,-1.525; 3 0.25,-1.525; 4 0.75,-1.525; 5 0.75,1.525; 6 0.25,1.525; 7 -0.25,1.525; 8 -0.75,1.525 | smd 1.6 x 1.4: 9 0,0

### Placement (x,y rotation side)
C1  6.87,6.47 0 top
C2  11.27,12.5 0 top
C3  14.16,13 180 top
C4  27.85,4.45 90 top
C5  7.24,3.5 90 top
C7  6.26,3.5 90 top
C8  37.55,3.31 180 top
C9  39.51,3.32 180 top
C17  18.92,3.8 270 top
C18  16.89,12.68 270 top
C21  26.35,14.55 90 top
C23  28.16,10.41 0 top
C24  22.96,3.83 270 top
C25  21.91,3.83 270 top
C27  17.6,14.52 180 top
D1  7.23,9.3 90 top
D2  7.9,12.95 180 top
D+  1.78,11.81 0 top
D-  1.78,14.35 0 top
DL1  1.9,3.1 180 top
DL2  1.9,14.7 180 top
FD1  7.94,12.99 0 top
FD2  42.01,5.01 0 top
FRAME1  0,-3.48 0 top  (outside the outline)
IC1  15.75,5.2 0 top
J1  1.28,8.89 270 top
J3  42,8.86 270 top
J4  40.54,8.89 90 top
JP2  21.59,1.27 0 top
JP3  21.59,16.51 180 top
L3  28.06,8.23 90 top
PB1  11.09,8.89 90 top
R1  6.77,4.97 180 top
R2  5.4,14.7 0 top
R3  4.8,3.09 0 top
R4  23.98,3.85 270 top
R5  11.27,13.6 0 top
R6  13.34,4.26 270 top
R7  35.5,14.63 180 top
R8  12.28,4.22 90 top
R9  13.84,10.9 270 top
R10  15.29,10.59 0 top
R13  20.92,3.81 90 top
R14  19.93,3.8 90 top
SJ1  31.76,4.2 270 bottom
TP_GPIO0  30.62,9.78 0 top
TP_RST  35.99,13.79 0 top
TP_RX  35.16,11.41 0 top
TP_TX  31.69,12.51 0 top
U1  22.24,10.09 180 top
U2  34.97,8.9 180 top
U3  10,4.26 180 top
U4  28.08,12.93 0 top
U$1  0,-3.48 0 top  (outside the outline)

### Tracks (layer width: path | path; a pad name or v marks a point on that pad's centre or on a via)
+3V3  (via drill 0.2)
  Top 0.254: 17.35,3.1 v17.69,3.1 17.69,3.12 v17.69,3.98 | 17.4,3.95 IC1.8 IC1.20 | v17.69,3.98 17.4,3.98 | R6.2 13.04,3.81 v13,3.85 | U1.36 18.93,7.13 18.93,5.09 v18.88,5.04 18.92,4.99 C17.1 | C17.1 R14.2 19.94,4.26 R13.2 | C17.1 18.24,4.25 17.96,3.98 v17.69,3.98 | U1.44 v22.99,4.78 | v22.99,4.78 22.99,4.31 C24.1 | R4.2 23.98,3 v24.6,3 | v22.99,4.78 v22.99,4.79 | U4.8 27.18,14.45 26.83,14.1 C21.1 25.91,14.1 v25.68,13.87 | U1.17 22.99,14.32 v22.77,14.54 | 17.4,3.98 17.4,4.8 IC1.9 17.71,4.8 v17.69,4.81 17.69,4 v17.69,3.98 | 17.4,3.98 17.4,3.95 | 17.4,3.95 17.4,3.15 17.35,3.1 | U2.10 39.18,4.61 v39.59,4.61 | IC1.7 17.35,3.1 | R7.2 34.48,14.63 34.48,14.64 34.42,14.64 v34.41,14.62 | v8.89,5.64 8.89,5.08 U3.8 | U3.12 9.5,2.75 9.51,2.74 9.51,2.7 v9.5,2.69 | U3.5 10.5,5.45 10.69,5.64 10.73,5.64 10.8,5.71 v10.88,5.71
  Top 0.305: L3.1 28.13,7.36 v28.81,7.36 | R2.2 5.9,14.75 v6.44,14.75 | R5.2 11.72,14.13 11.65,14.2 v11.6,14.2 | C18.1 15.29,13.13 C3.1 15.16,14.16 v15.25,14.25
  Top 0.61: U2.10 39.02,3.37 C9.2 39.06,2.81 v39,2.75 | U2.9 38.02,3.26 38,3.28 C8.1 v38,2.75
  Bottom 0.254: J4.1 39.59,6.03 v39.59,4.61
  pour PWR: 0,18 44,18 44,11.2 38.44,11.2 38.44,6.65 44.01,6.65 44,6.53 44,0 0,0
A0/DAC0  (via drill 0.2)
  Top 0.254: U1.3 25.79,8.32 26.23,8.32 26.52,8.02 v26.52,7.19 v26.53,7.18
  MID 0.254: v26.53,7.18 26.52,7.17 26.27,7.17 26.18,7.26 19.06,7.26 18.62,6.83 18.62,6.02 v18.39,5.79
  Bottom 0.254: JP2.4 11.43,3.56 12.33,4.46 16.34,4.46 17.27,5.39 17.99,5.39 v18.39,5.79
A1  (via drill 0.2)
  Top 0.254: U1.47 24.49,5.52 25.12,4.89 v25.52,4.89
  PWR 0.254: JP2.5 15.15,2.45 24.81,2.45 25.52,3.16 v25.52,4.89
A2  (via drill 0.2)
  Top 0.254: U1.16 23.51,13.64 v23.51,14.6 v23.52,14.6
  Bottom 0.254: v23.52,14.6 23.52,14.51 23.02,14.01 23.02,5.75 21.32,4.06 20.24,4.06 17.45,1.27 JP2.6
A3  (via drill 0.2)
  Top 0.254: U1.15 23.99,14.34 24.09,14.44 v24.09,14.88
  Bottom 0.254: JP2.7 19.05,1.7 20.95,3.6 22.84,3.6 23.57,4.34 23.57,13.9 24.09,14.41 v24.09,14.88
A4/SDA  (via drill 0.2)
  Top 0.254: R14.1 19.93,2.93 20.02,2.84 | 20.02,2.84 JP2.8 | v26.75,10.13 26.54,10.34 U1.7 | U2.35 31.65,10.55 v32.77,11.68 | v32.3,14.55 28.93,14.55 U4.5 | U3.14 10.5,2.95 10.96,2.49 19.67,2.49 20.02,2.84
  MID 0.254: v26.7,2.9 26.68,2.9 26.14,2.37 22.98,2.37 21.88,1.27 JP2.8
  Bottom 0.254: v26.75,10.13 26.54,9.92 | 26.54,9.92 25.85,9.23 25.85,7.64 24.95,6.74 24.95,4.7 25.9,3.75 26.38,3.75 26.7,3.43 v26.7,2.9 | v32.3,14.55 32.3,14.47 32.42,14.47 32.81,14.09 32.81,11.71 v32.77,11.68 31.62,10.53 28.65,10.53 27.58,9.46 27.14,9.46 26.68,9.92 26.54,9.92
A5/SCL  (via drill 0.2)
  Top 0.254: 21.19,3.02 21.7,2.51 23.09,2.51 24.13,1.47 JP2.9 | 21.19,3.02 20.92,3.29 R13.1 | U1.8 25.77,10.85 26.47,10.85 26.52,10.81 26.84,10.81 v26.93,10.72 | U4.6 28.3,14.48 28.3,14.9 28.54,15.14 32.53,15.14 33.1,14.57 v33.1,14.55 | v33.1,6.94 32.5,6.94 31.72,6.15 U2.31 | U3.13 10,2.94 10.04,2.9 10.04,1.71 v10.01,1.68 | v21.19,2.99 21.19,3.02
  PWR 0.254: JP2.9 24.36,1.27 26.16,3.07 v26.16,3.22
  MID 0.254: v10.01,1.68 10.28,1.68 10.96,2.36 20.56,2.36 v21.19,2.99
  Bottom 0.254: v33.1,6.94 33.31,7.14 33.31,14.24 33.1,14.45 v33.1,14.55 32.49,15.16 30.62,15.16 27.32,11.86 27.32,11.11 v26.93,10.72 26.87,10.66 26.53,10.66 25.37,9.51 25.37,7.81 24.49,6.92 24.49,4.51 25.78,3.22 v26.16,3.22
A6  (via drill 0.2)
  Top 0.203: U2.5 34.02,4.12 33.2,3.3 v33.09,3.3
  Top 0.254: U1.14 24.49,14.21 24.71,14.44 v24.71,14.82
  MID 0.203: v33.09,3.3 30.29,3.3 29.51,2.52 27.92,2.52 JP2.10
  Bottom 0.254: JP2.10 26.67,1.68 24.03,4.32 24.03,13.71 24.62,14.3 24.62,14.73 v24.71,14.82
A7  (via drill 0.2)
  Top 0.203: U2.8 36.67,4.43 36.67,4.08 35.96,3.36 35.59,3.36 v35.59,3.35 v35.59,3.34
  Top 0.254: U1.48 24.99,5.67 25.16,5.5 25.7,5.5 26.13,5.07 v26.13,4.81
  MID 0.203: v35.59,3.34 35.03,2.79 30.64,2.79 29.21,1.36 JP2.11
  Bottom 0.254: JP2.11 27.16,3.32 27.16,3.62 26.13,4.64 v26.13,4.81
AREF  (via drill 0.2)
  Top 0.254: C7.1 7.22,3.07 C5.1 8.89,1.4 JP2.3 | U1.4 25.79,8.82 26.38,8.82 27.06,8.14 v27.06,7.62
  MID 0.254: v27.06,7.62 27.06,7.68 27.02,7.72 18.87,7.72 18.09,6.93 v18.09,6.32
  Bottom 0.254: v18.09,6.32 17.28,6.32 15.89,4.94 9.93,4.94 8.89,3.9 JP2.3
D2  (via drill 0.2)
  Top 0.254: U1.19 22.01,13.64 22.01,14.61 22.5,15.1 v23.15,15.1
  MID 0.254: JP3.5 29.09,16.51 28.56,15.98 27.85,15.98 26.84,14.97 26.84,14.26 25.85,13.27 23.25,13.27 22.12,14.41 22.12,14.74 22.47,15.1 v23.15,15.1
D3~  (via drill 0.2)
  Top 0.254: U1.20 21.51,13.64 21.51,14.76 22.4,15.65 22.53,15.65 v22.61,15.73
  PWR 0.254: v22.61,15.73 23.36,15.73 23.68,15.42 25.58,15.42 JP3.6
D4  (via drill 0.2)
  Top 0.254: U1.12 25.98,12.84 26.57,13.43 v26.85,13.43
  Bottom 0.254: v26.85,13.43 26.85,13.79 JP3.7
D5~  (via drill 0.2)
  Top 0.254: U1.10 26.39,11.84 26.45,11.9 v26.49,11.9
  PWR 0.254: v26.49,11.9 24.35,11.9 22.05,14.2 22.05,16.12 21.66,16.51 JP3.8
D6~  (via drill 0.2)
  Top 0.254: v26.76,11.34 U1.9
  PWR 0.254: v26.76,11.34 26.73,11.37 24.23,11.37 21.59,14.01 21.59,14.96 20.05,16.51 JP3.9
D7  (via drill 0.2)
  Top 0.254: U1.11 25.79,12.36 26.22,12.36 26.3,12.44 26.8,12.44 v26.88,12.37
  PWR 0.254: JP3.10 16.51,16.11 19.82,12.8 21.43,12.8 23.78,10.45 25.03,10.45 26.38,9.11 27.33,9.11 27.9,9.67 27.9,11.62 27.15,12.37 v26.88,12.37
D8  (via drill 0.2)
  Top 0.254: U1.27 18.01,11.84 v17.75,12.1
  MID 0.254: v17.75,12.1 18.62,12.1 18.98,12.45 18.98,13.43 18.62,13.78 17.25,15.15 15.3,15.15 13.97,16.48 JP3.11
D9~  (via drill 0.2)
  Top 0.254: U1.29 17.29,10.84 v17.22,10.91
  PWR 0.254: JP3.12 11.94,16.51 13.04,15.41 16.56,15.41 17.21,14.77 17.21,10.92 v17.22,10.91
D10~  (via drill 0.2)
  Top 0.203: U1.30 18.32,10.34 18.29,10.38
  Top 0.254: 18.29,10.38 17.71,10.38 v17.56,10.23
  MID 0.254: v7.5,14.4 8.89,15.79 JP3.13
  Bottom 0.254: v17.56,10.23 17.73,10.4 17.74,10.4 17.75,10.41 17.75,11.43 17.59,11.59 16.86,11.59 15.26,13.19 9.34,13.19 8.48,14.05 7.85,14.05 v7.5,14.4
GND  (via drill 0.2)
  Top 0.203: U1.5 22.99,9.34 22.63,9.7 | 22.63,9.7 U1.49 22.49,10.34 U1.18 | 21.99,6.95 21.99,9.06 22.63,9.7
  Top 0.254: IC1.3 13.77,5.45 v13.77,5.5 | PB1.5 12.12,6.82 PB1.2 | C24.2 22.63,3.05 v22.49,3.05 22.24,3.05 C25.2 | U1.42 21.99,6.95 | U4.4 29.07,11.4 v29.6,11.93 | 7.3,4.02 C5.2 | U3.1 11.19,3.52 11.59,3.52 11.59,3.91 11.49,4.01 | 12.21,3.84 R8.1 12.22,3.83 11.84,3.83 11.65,4.01 | U3.2 11.49,4.01 | 11.49,4.01 11.65,4.01 | U3.3 11.44,4.52 11.62,4.34 11.62,4.04 11.65,4.01 | U3.7 9.5,5.83 | U3.6 10,5.84 | C17.2 18.42,3.35 v18.29,3.49 | IC1.12 17.76,6.75 17.87,6.85 17.9,6.85 17.93,6.88 17.8,7 v17.8,7.8
  Top 0.305: U4.4 28.83,10.63 C23.2
  other vias: 2.7,2.1 9.43,11.39 11.1,7.85 5.53,7.71 9.85,11.95 13.3,14.35 19.95,12.24 25.4,16.35 29.04,6.79 34.98,7.21 32.64,7.47 19.84,8.36 33.4,15.43 27.95,16.56 30.52,14.01 30.5,15.81 28.01,15.38 17.81,15.93 22.85,16.86 26.31,15.38 24.75,12.69 22.43,8.5 9.78,6.05 13.38,3.02 30.71,7.14
  pour Bottom: 0,18 44,18 44,0 0,0 0,17
  pour Top: 0,18 44,18 44,0 0,0
  pour MID: 0.05,18 44,18 44,11.24 38.39,11.24 38.39,6.7 44.02,6.7 44,6.51 44,0 0,0 0,17.8
MISO~  (via drill 0.2)
  Top 0.203: U1.28 17.68,11.34 17.41,11.61 16.35,11.61 v16.07,11.34
  Top 0.254: v16.07,11.34 v16.07,11.35
  Bottom 0.254: JP3.15 7.11,13.21 8.67,13.21 9.15,12.74 14.69,12.74 v16.07,11.35
MOSI  (via drill 0.2)
  Top 0.254: U1.25 18.4,13.15 v18.4,13.25
  Bottom 0.254: v18.4,13.25 18,13.65 9.53,13.65 9.15,14.03 9.15,14.86 8.68,15.33 7.53,15.33 JP3.14
N17852357  (via drill 0.2)
  Top 0.254: U1.6 25.79,9.82 26.3,9.82 26.87,9.25 27.38,9.25 | L3.2 27.84,9.25 27.38,9.25 | v27.36,10.19 27.38,10.18 27.38,9.25
  Top 0.305: C23.1 27.59,10.41 v27.36,10.19 | C27.1 18.93,14.52 v18.9,14.55
  PWR 0.254: v27.36,10.19 27.36,9.99 26.97,9.6 26.53,9.6 25.22,10.91 24.05,10.91 24.04,10.91 24.01,10.91 21.77,13.15 21.73,13.15 21.62,13.26 20.19,13.26 v18.9,14.55
N17852431
  Top 0.254: U1.43 22.47,6.54 22.47,6.1 22.46,6.1 22.46,4.98 21.91,4.43 C25.1
N$1
  Top 0.61: C1.1 6.48,7.09 D1.1 | C1.1 5.18,5.79 J1.6 4.18,5.02 4.2,5 4.09,4.89 J1.7 J1.8 J1.9 J1.10 4.11,12.89 4.2,12.8 4.18,12.78 J1.11 | C1.1 5.87,5.42 R1.2
N$2  (via drill 0.2)
  Top 0.254: R2.1 v4.2,14.7 | v1.81,15.31 1.71,15.31 DL2.A
  Bottom 0.254: v4.2,14.7 3.59,15.31 v1.81,15.31
N$3  (via drill 0.2)
  Top 0.254: v1.6,3.1 DL1.A | R3.1 v3.56,3.09
  Bottom 0.254: v3.56,3.09 1.61,3.09 v1.6,3.1
N$4
  Top 0.406: J3.SIG 38.98,8.86 U2.13
N$5
  Top 0.254: R8.2 12.64,4.71 R6.1 13.02,5.03 13.02,6.12 13.65,6.75 IC1.1
N$6  (via drill 0.2)
  Top 0.254: IC1.18 14.5,8 13.81,8 v13.6,7.79 | v14.11,10.18 R9.2
  Bottom 0.254: v13.6,7.79 13.6,9.66 v14.11,10.18
N$7  (via drill 0.2)
  Top 0.254: IC1.17 14.96,7.69 14.96,8.39 14.72,8.63 13.08,8.63 13.02,8.57 v13.02,8.59 | R10.1 14.84,10.1 v14.8,10.06
  PWR 0.254: v13.02,8.59 13.66,8.59 14.8,9.72 v14.8,10.06
N$8
  Bottom 0.406: SJ1.2 31.76,1.28 JP2.12
PA12_S2_TX/MOSI  (via drill 0.2)
  Top 0.254: U1.21 20.99,14.44 21.02,14.47 21,14.47 v20.98,14.5 | U2.36 30.87,11.65 v30.86,11.66
  MID 0.254: v20.98,14.5 21.24,14.5 26.15,9.59 27.53,9.59 27.97,10.04 27.97,10.3 28.63,10.96 30.21,10.96 30.86,11.61 v30.86,11.66
PA13_S2_RX/MISO  (via drill 0.2)
  Top 0.254: U1.22 20.49,14.24 20.45,14.28 20.45,14.9 20.68,15.12 v20.69,15.11 | v29.88,6.01 29.88,4.92 U2.1
  MID 0.254: v20.69,15.11 20.69,14.96 20.45,14.72 20.45,14.28 20.76,13.97 21.13,13.97 25.96,9.14 27.72,9.14 29.02,10.43 29.52,10.43 30.17,9.78 30.17,6.23 29.88,5.94 v29.88,6.01
PA14_S2_RTS/CS  (via drill 0.2)
  Top 0.254: v29.16,8.91 29.17,8.9 U2.28 30.72,8.9 v30.75,8.88 | v19.88,15.35 19.99,15.24 U1.23 | v33.98,12.22 33.98,12.98 U2.21
  MID 0.254: v29.16,8.91 28.18,8.91 27.94,8.68 25.4,8.68 19.96,14.11 19.96,15.31 19.93,15.35 v19.88,15.35 | v30.75,8.88 33.98,12.11 v33.98,12.22
PA15_S2_CTS/SCK  (via drill 0.2)
  Top 0.254: U1.24 19.49,14.98 v19.18,15.3 | v29.14,7.88 29.16,7.9 U2.29 30.69,7.9 v30.73,7.86 | v35,12.22 35,13.01 U2.20
  MID 0.254: v19.18,15.3 19.18,15.28 19.48,14.97 19.48,13.94 25.21,8.21 28.8,8.21 v29.14,7.88 | v30.73,7.86 30.73,7.92 35,12.2 v35,12.22
PA27_GPIO0  (via drill 0.2)
  Top 0.254: U2.27 v29.3,9.9 | v20.5,5.7 v20.49,5.71 U1.39
  MID 0.254: v29.3,9.9 29.7,9.5 29.7,6.64 28.73,5.66 20.54,5.66 v20.5,5.7
  Bottom 0.254: TP_GPIO0.X 30.5,9.9 v29.3,9.9
PA28_ACK  (via drill 0.2)
  Top 0.254: U1.41 21.49,5 v21.48,4.98 | v35.95,5.85 35.95,4.84 U2.7
  MID 0.254: v21.48,4.98 22.21,4.25 26.69,4.25 27.59,3.36 28.31,3.36 29.2,4.25 34.35,4.25 v35.95,5.85
PA30_SWCLK  (via drill 0.2)
  Top 0.254: U1.45 23.49,5.12 23.98,4.63 R4.1 24.32,4.3 26.25,2.37 32.99,2.37 v33.11,2.25
  Bottom 0.254: v33.11,2.25 33.24,2.37 33.87,2.37 37.71,6.22 37.71,7.45 39.15,8.89 J4.3
PA31_SWDIO  (via drill 0.2)
  Top 0.254: U1.46 24.01,6.54 24.01,5.36 25.11,4.26 28.34,4.26 v28.43,4.34 | v36.44,6.36 36.89,5.91 38.42,5.91 v38.44,5.92
  MID 0.254: v28.43,4.34 28.64,4.34 29.01,4.71 34.05,4.71 35.73,6.38 36.17,6.38 36.18,6.38 36.42,6.38 v36.44,6.36
  Bottom 0.254: v38.44,5.92 38.46,5.92 38.36,6.03 38.36,7.19 38.56,7.39 40.77,7.39 J4.2
RESETN  (via drill 0.2)
  Top 0.254: R5.1 C2.1 10.82,11.23 PB1.6 11.05,10.93 v11.05,10.3 | U1.40 20.99,5.96 21.03,5.92 21.03,5.33 v20.7,5
  MID 0.203: 37.44,3.82 37.47,3.85 37.47,11.46 | 37.44,3.82 35.84,3.82 35.8,3.85 35.38,3.85 35.35,3.82 30.23,3.82 29.34,2.92 27.4,2.92 26.57,3.75 21.95,3.75 v20.7,5 20.63,5 20.12,4.49 18.7,4.49 18.37,4.83 18.37,4.92 12.99,10.3 v11.05,10.3 | 37.44,3.82 34.89,1.27 JP2.13 | JP3.3 34.97,16.51 37.47,14.01 37.47,11.46 | v37.79,11.45 37.78,11.46 37.47,11.46
  Bottom 0.254: v37.79,11.45 v37.8,11.44 37.8,11.16 38.64,10.32 40.7,10.32 J4.6
RSTN_NINA  (via drill 0.2)
  Top 0.254: U1.13 24.99,14.06 25.36,14.44 25.39,14.44 v25.4,14.45 | v35.95,12.16 36.02,12.23 U2.19 35.95,13.1 R7.1
  PWR 0.254: v25.4,14.45 25.51,14.56 31.52,14.56 32.07,14.02 33.09,14.02 33.1,14.01 34.11,14.01 35.98,12.15 35.96,12.15 v35.95,12.16
  Bottom 0.254: TP_RST.X 35.99,12.2 v35.95,12.16
RX  (via drill 0.2)
  Top 0.254: U1.38 19.99,5.94 19.97,5.92 19.97,5.37 v20.12,5.22
  MID 0.254: v20.12,5.22 19.97,5.37 19.97,5.92 20.39,6.35 25.8,6.35 25.98,6.17 27.34,6.17 27.56,6.39 v28.56,6.39
  Bottom 0.254: v28.56,6.39 28.77,6.18 29.19,6.18 29.57,6.56 32.64,6.56 32.64,6.55 32.8,6.39 34.96,6.39 36.8,8.24 36.8,16.48 JP3.2
RX_NINA_PROG  (via drill 0.19)
  Top 0.203: v34.75,10.75 35.62,11.62 37.12,11.62 37.62,12.12 39.47,12.12 39.75,12.4 39.75,13.71 38.21,15.25 34.25,15.25 33.62,14.62 33.62,14.25 33.02,13.64 U2.22 | U1.32 18.68,9.3 17.81,9.3 v17.49,9.62
  PWR 0.203: v17.49,9.62 v17.5,9.62 17.84,9.29 24.98,9.29 26,8.26 27.76,8.26 28.75,9.25 28.75,10.12 29.38,10.75 v34.75,10.75
  Bottom 0.254: TP_RX.X 34.75,11 v34.75,10.75
SCK  (via drill 0.2)
  Top 0.254: JP2.1 5.22,2.68 5.22,3.06 R3.2 | U1.26 18.27,12.34 17.85,12.76 17.85,13.04 v17.77,13.12
  MID 0.254: v17.77,13.12 12.97,13.12 5.83,5.97 5.83,3.29 JP2.1
TX  (via drill 0.2)
  Top 0.254: U1.37 19.49,5.23 v19.46,5.2
  MID 0.254: v19.46,5.2 19.46,6.06 20.2,6.8 25.99,6.8 26.17,6.63 26.97,6.63 27.05,6.71 27.05,6.94 v27.12,7.01
  Bottom 0.254: JP3.1 38.4,16.51 37.26,15.37 37.26,8.04 35.21,6 35.15,5.94 30.56,5.94 30.06,5.44 27.84,5.44 27.27,6.01 27.27,6.87 v27.12,7.01
TX_NINA_PROG  (via drill 0.2)
  Top 0.203: U1.31 v18.07,9.84 v18.06,9.84 | U2.23 32.02,12.23 32.12,12.13 32.12,12.08 v32.24,11.96
  PWR 0.203: v18.06,9.84 25,9.84 26.17,8.67 27.59,8.67 28.34,9.42 28.34,10.29 29.21,11.16 31.99,11.16 32.19,11.36 32.19,11.91 v32.24,11.96
  Bottom 0.254: v32.24,11.96 TP_TX.X
USB_N  (via drill 0.19)
  Top 0.203: D1.3 8.18,9.55 | U1.33 arc90 U1.33 16.7,8.85 arc-90 16.4,9.15 16.39,9.15 arc90 15.98,9.55 8.18,9.55 | 8.18,9.55 4.32,9.55 J1.2 3.33,9.54 3.34,9.55 v3.38,9.55
  Bottom 0.203: v3.38,9.55 2.59,10.35 2.59,13.84 2.17,14.26 1.87,14.26 D-.X
USB_P  (via drill 0.2)
  Top 0.203: D1.2 8.2,8.17 8.2,9.15 | U1.34 U1.34 arc90 18.67,8.39 16.43,8.39 arc-90 16.06,8.75 arc90 15.67,9.15 8.2,9.15 | 8.2,9.15 5.21,9.15 5.06,9 4.41,9 arc90 J1.3 v3.34,8.89
  Bottom 0.203: v3.34,8.89 1.78,10.45 D+.X
VIN  (via drill 0.2)
  Top 0.203: 15.55,8.45 15.55,8.58 v15.56,8.59
  Top 0.254: IC1.16 15.5,8.4 15.55,8.45
  Top 0.406: v16.12,10.54 15.79,10.54 R10.2
  Top 0.61: C4.1 v29.15,3.45 | D2.C 9.51,14.11 v9.75,14.35
  PWR 0.406: v9.75,14.35 12.4,11.7 14.87,11.7 16,10.56 16.11,10.56 v16.12,10.55 v16.12,10.54 15.78,10.19 15.78,9.61 15.53,9.36 15.53,8.62 v15.56,8.59 17.11,7.04 22.21,7.04 23.24,6.01 26.54,6.01 27.33,5.22 27.33,5.18 27.41,5.11 28.68,5.11 29.15,4.64 v29.15,3.45 29.22,3.52 29.22,4.07 38.53,4.07 39.61,3 39.61,1.83 39.37,1.59 JP2.15
VUSB  (via drill 0.2, 0.3)
  Top 0.305: D2.A 6.29,13.05 5.78,13.57 v5.78,13.6
  Top 0.406: J1.1 4.57,10.45 D1.4 6.28,13.09
  Top 0.61: D2.A 6.29,10.46 D1.4
  PWR 0.305: v5.78,13.6 10.97,8.41 11.65,8.41 14,6.06 17.34,6.06 18.32,5.08 18.32,4.81 18.7,4.42 21.71,4.42 22.73,5.45 26.31,5.45 26.72,5.04 v26.72,4.96
  Bottom 0.254: SJ1.1 v26.72,4.96
(copper drawn outside any net)
  shapes: Top area x2

### Text on the board
test-probe: 5V | VIN(5V) | VCC | GND | RESET | 14 | 13 | 12 | 11 | 10 | 9 | 8 | 7 | 6 | USB_5V | USB_D- | SWCLK | SWDIO | JGND | JRST | VTG | BATT+ | BATT- | USB_D+ | USB_GND | AREF | A0 | A1 | A2 | A3 | A4 | A5 | A6 | 0 | 1 | 2 | 3 | 4 | 5